# Altium project 51最小系统板-电子科技制作.PrjPcb
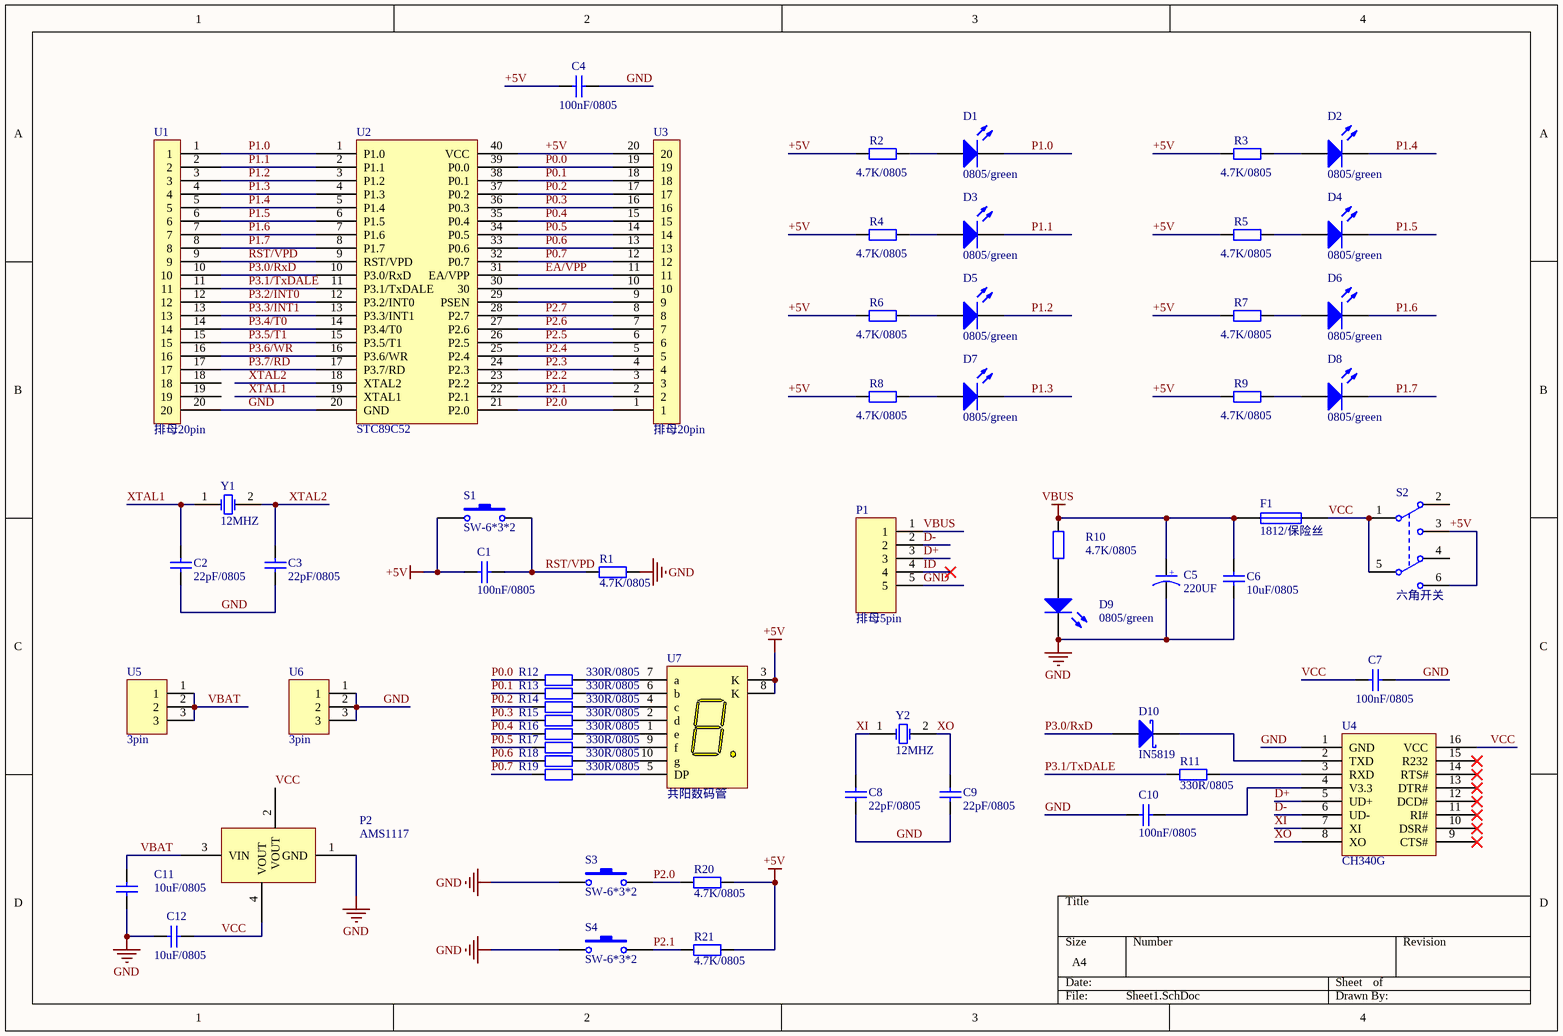
[diagram p0: Sheet1.SchDoc]
1 sheet, 59 parts. Net scope: global (net labels, ports and power ports of the same name join across sheets).
Board file: PCB1.PcbDoc

## Sheet Sheet1.SchDoc
size A4; SheetNumber: 1; SheetTotal: 1

### Parts
C1  100nF/0805  [C_0805]
C2  22pF/0805  [C_0805]
C3  22pF/0805  [C_0805]
C4  100nF/0805  [C_0805]
C5  220UF  [C-电解电容]
C6  10uF/0805  [C_0805]
C7  100nF/0805  [C_0805]
C8  22pF/0805  [C_0805]
C9  22pF/0805  [C_0805]
C10  100nF/0805  [C_0805]
C11  10uF/0805  [C_0805]
C12  10uF/0805  [C_0805]
D1  0805/green  [LED_0805]
D2  0805/green  [LED_0805]
D3  0805/green  [LED_0805]
D4  0805/green  [LED_0805]
D5  0805/green  [LED_0805]
D6  0805/green  [LED_0805]
D7  0805/green  [LED_0805]
D8  0805/green  [LED_0805]
D9  0805/green  [LED_0805]
D10  IN5819  [D-SMA]
F1  1812/保险丝  [FUSE-1812]
P1  排母5pin  [排母2.54-5PIN]
P2  AMS1117  [AMS1117]
R1  4.7K/0805  [R_0805]
R2  4.7K/0805  [R_0805]
R3  4.7K/0805  [R_0805]
R4  4.7K/0805  [R_0805]
R5  4.7K/0805  [R_0805]
R6  4.7K/0805  [R_0805]
R7  4.7K/0805  [R_0805]
R8  4.7K/0805  [R_0805]
R9  4.7K/0805  [R_0805]
R10  4.7K/0805  [R_0805]
R11  330R/0805  [R_0805]
R12  330R/0805  [R_0805]
R13  330R/0805  [R_0805]
R14  330R/0805  [R_0805]
R15  330R/0805  [R_0805]
R16  330R/0805  [R_0805]
R17  330R/0805  [R_0805]
R18  330R/0805  [R_0805]
R19  330R/0805  [R_0805]
R20  4.7K/0805  [R_0805]
R21  4.7K/0805  [R_0805]
S1  SW-6*3*2  [SW-3*6*2.5]
S2  六角开关  [六角开关7X7]
S3  SW-6*3*2  [SW-3*6*2.5]
S4  SW-6*3*2  [SW-3*6*2.5]
U1  排母20pin  [20PIN-2.54]
U2  STC89C52  [STC89C51]
U3  排母20pin  [20PIN-2.54]
U4  CH340G  [CH340G]
U5  3pin  [3PIN-2.54]
U6  3pin  [3PIN-2.54]
U7  共阳数码管  [数码管]
Y1  12MHZ  [HC495]
Y2  12MHZ  [HC495]

### Nets
+5V: C1.2 C4.2 R2.1 R3.1 R4.1 R5.1 R6.1 R7.1 R8.1 R9.1 R20.1 R21.1 S1.1 S2.3(NO1) S2.6(NO2) U2.40(VCC) U3.20 U7.3(K) U7.8(K)
GND: C2.1 C3.1 C4.1 C5.2 C6.2 C7.1 C8.1 C9.1 C10.1 C11.1 C12.2 D9.2 P1.5 P2.1(GND) R1.1 S3.1 S4.1 U1.20 U2.20(GND) U4.1(GND) U6.1 U6.2 U6.3
VBUS: C5.1(A) C6.1 F1.2 P1.1 R10.1
D+: P1.3 U4.5(UD+)
D-: P1.2 U4.6(UD-)
EA/VPP: U2.31(EA/VPP) U3.11
ID: P1.4
P0.0: R12.2 U2.39(P0.0) U3.19
P0.1: R13.2 U2.38(P0.1) U3.18
P0.2: R14.2 U2.37(P0.2) U3.17
P0.3: R15.2 U2.36(P0.3) U3.16
P0.4: R16.2 U2.35(P0.4) U3.15
P0.5: R17.2 U2.34(P0.5) U3.14
P0.6: R18.2 U2.33(P0.6) U3.13
P0.7: R19.2 U2.32(P0.7) U3.12
P1.0: D1.2 U1.1 U2.1(P1.0)
P1.1: D3.2 U1.2 U2.2(P1.1)
P1.2: D5.2 U1.3 U2.3(P1.2)
P1.3: D7.2 U1.4 U2.4(P1.3)
P1.4: D2.2 U1.5 U2.5(P1.4)
P1.5: D4.2 U1.6 U2.6(P1.5)
P1.6: D6.2 U1.7 U2.7(P1.6)
P1.7: D8.2 U1.8 U2.8(P1.7)
P2.0: R20.2 S3.2 U2.21(P2.0) U3.1
P2.1: R21.2 S4.2 U2.22(P2.1) U3.2
P2.2: U2.23(P2.2) U3.3
P2.3: U2.24(P2.3) U3.4
P2.4: U2.25(P2.4) U3.5
P2.5: U2.26(P2.5) U3.6
P2.6: U2.27(P2.6) U3.7
P2.7: U2.28(P2.7) U3.8
P3.0/RxD: D10.2(A) U1.10 U2.10(P3.0/RxD)
P3.1/TxDALE: R11.1 U1.11 U2.11(P3.1/TxDALE)
P3.2/INT0: U1.12 U2.12(P3.2/INT0)
P3.3/INT1: U1.13 U2.13(P3.3/INT1)
P3.4/T0: U1.14 U2.14(P3.4/T0)
P3.5/T1: U1.15 U2.15(P3.5/T1)
P3.6/WR: U1.16 U2.16(P3.6/WR)
P3.7/RD: U1.17 U2.17(P3.7/RD)
RST/VPD: C1.1 R1.2 S1.2 U1.9 U2.9(RST/VPD)
VBAT: C11.2 P2.3(VIN) U5.1 U5.2 U5.3
VCC: C7.2 C12.1 F1.1 P2.2(VOUT) P2.4(VOUT) S2.1(COMMON1) S2.5(COMMON2) U4.16(VCC)
XI: C8.2 U4.7(XI) Y2.1(OSC1)
XO: C9.2 U4.8(XO) Y2.2(OSC2)
XTAL1: C2.2 U2.19(XTAL1) Y1.1(OSC1)
XTAL2: C3.2 U2.18(XTAL2) Y1.2(OSC2)
NetC10_2: C10.2 U4.4(V3.3)
NetD1_1: D1.1(A1) R2.2
NetD2_1: D2.1(A1) R3.2
NetD3_1: D3.1(A1) R4.2
NetD4_1: D4.1(A1) R5.2
NetD5_1: D5.1(A1) R6.2
NetD6_1: D6.1(A1) R7.2
NetD7_1: D7.1(A1) R8.2
NetD8_1: D8.1(A1) R9.2
NetD9_1: D9.1(A1) R10.2
NetD10_1: D10.1(K) U4.2(TXD)
NetR11_2: R11.2 U4.3(RXD)
NetR12_1: R12.1 U7.7(a)
NetR13_1: R13.1 U7.6(b)
NetR14_1: R14.1 U7.4(c)
NetR15_1: R15.1 U7.2(d)
NetR16_1: R16.1 U7.1(e)
NetR17_1: R17.1 U7.9(f)
NetR18_1: R18.1 U7.10(g)
NetR19_1: R19.1 U7.5(DP)
NetU2_29: U2.29(PSEN) U3.9
NetU2_30: U2.30 U3.10

Not connected (* = marked no-connect by the designer): S2 2(NC1) 4(NC2); U1 18 19; U4 9(CTS#)* 10(DSR#)* 11(RI#)* 12(DCD#)* 13(DTR#)* 14(RTS#)* 15(R232)*

### Notes on the sheet
- (in symbol Cap2) +

### Library data of the parts
C1 C4 C6 C7 C10 = Cap1_1: 贴片电容
C2 C3 C8 C9 C11 C12 = Cap1: 贴片电容
C5 = Cap2: 电解电容
D1-D9 = LED: 发光二极管
D10 = Diode_SCHOTTKY: 肖特基二极管
F1 = FUSE: 贴片保险丝
R1-R21 = Res1_1: 贴片电阻
Y1 Y2 = XTAL_2P: 二脚无源晶振